# Altium schematic sheet 3V3_SUPPLY.SchDoc
size A2; SheetNumber: 5; SheetTotal: 16
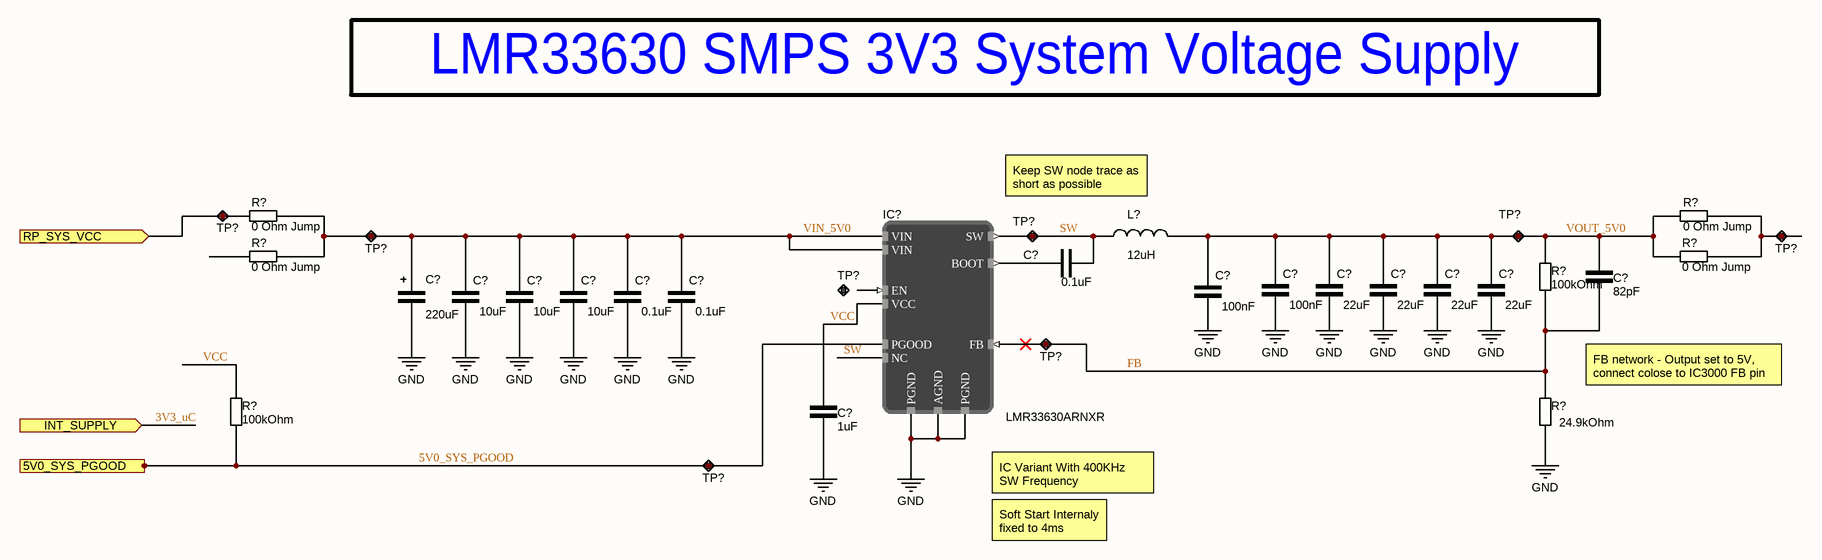
[diagram p0: 3V3_SUPPLY.SchDoc]

## Parts
(Parts that share a designator on the sheet are numbered #1, #2 ... from top to bottom, then left to right.)
C?#1  0.1uF  [CAP_0603]
C?#2  82pF  [CAP_0603]
C?#3  100nF  [CAP_0603]
C?#4  100nF  [CAP_0603]
C?#5  22uF  [CAP_1206]
C?#6  22uF  [CAP_1206]
C?#7  22uF  [CAP_1206]
C?#8  22uF  [CAP_1206]
C?#9  220uF  [CAPAE109103X103M]
C?#10  10uF  [CAP_1206]
C?#11  10uF  [CAP_1206]
C?#12  10uF  [CAP_1206]
C?#13  0.1uF  [CAP_0603]
C?#14  0.1uF  [CAP_0603]
C?#15  1uF  [CAP_0603]
IC?  LMR33630ARNXR  [VQFN-HR]
L?  12uH  [INDM120120X80N]
R?#1  0 Ohm Jump  [RES_0805]
R?#2  0 Ohm Jump  [RES_1206]
R?#3  0 Ohm Jump  [RES_0805]
R?#4  0 Ohm Jump  [RES_1206]
R?#5  100kOhm  [RES_0603]
R?#6  100kOhm  [RES_0603]
R?#7  24.9kOhm  [RES_0603]
TP?#1  Test point  [TestPoint]  (value not drawn)
TP?#2  Test point  [TestPoint]  (value not drawn)
TP?#3  Test point  [TestPoint]  (value not drawn)
TP?#4  Test point  [TestPoint]  (value not drawn)
TP?#5  Test point  [TestPoint]  (value not drawn)
TP?#6  Test point  [TestPoint]  (value not drawn)
TP?#7  Test point  [TestPoint]  (value not drawn)
TP?#8  Test point  [TestPoint]  (value not drawn)

## Ports
5V0_SYS_PGOOD (out), INT_SUPPLY (in), RP_SYS_VCC (in)

## Nets
GND: C?#4.1 C?#5.1 C?#6.1 C?#7.1 C?#8.1 C?#9.1 C?#10.1 C?#11.1 C?#12.1 C?#13.1 C?#14.1 C?#15.1 IC?.1(PGND) IC?.6(AGND) IC?.11(PGND) R?#7.1
3V3_uC: port INT_SUPPLY
5V0_SYS_PGOOD: IC?.8(PGOOD) R?#6.1 TP?#8.1 ; port 5V0_SYS_PGOOD
FB: C?#2.1 IC?.7(FB) R?#5.1 R?#7.2 TP?#7.1
RP_SYS_VCC: R?#1.1 TP?#1.1 ; port RP_SYS_VCC
SW: C?#1.2 IC?.3(NC) IC?.12(SW) L?.1 TP?#3.1
VCC: C?#15.2 IC?.5(VCC) R?#6.2
VIN_5V0: C?#9.2 C?#10.2 C?#11.2 C?#12.2 C?#13.2 C?#14.2 IC?.2(VIN) IC?.10(VIN) R?#1.2 R?#3.2 TP?#2.1
VOUT_5V0: C?#2.2 C?#3.2 C?#4.2 C?#5.2 C?#6.2 C?#7.2 C?#8.2 L?.2 R?#2.2 R?#4.1 R?#5.2 TP?#4.1
NetC?#1_1: C?#1.1 IC?.4(BOOT)
NetR?#2_1: R?#2.1 R?#4.2 TP?#5.1

Not connected (* = marked no-connect by the designer): C?#3 1; IC? 9(EN); R?#3 1; TP?#6 1

## Notes on the sheet
- LMR33630 SMPS 3V3 System Voltage Supply
- Keep SW node trace as short as possible
- FB network - Output set to 5V, connect colose to IC3000 FB pin
- (near IC?) IC Variant With 400KHz SW Frequency
- Soft Start Internaly fixed to 4ms
- Labels drawn without touching a wire or pin: GND

## Library data of the parts
C?#1 C?#13 C?#14 = C000018: 0.1 µF ±10% 50V Ceramic Capacitor X7R 0603 (1608 Metric); ComponentLink1Description: DigiKey; ComponentLink1URL: https://www.digikey.com/en/products/detail/samsung-electro-mechanics/CL10B104KB8NNNC/3886658; DigiKey Part Number: 1276-1000-1-ND; capacitance: 0.1uF
C?#2 = C000021: 82 pF ±1% 25V Ceramic Capacitor C0G, NP0 0603 (1608 Metric); ComponentLink1Description: DigiKey; ComponentLink1URL: https://www.digikey.com/en/products/detail/kyocera-avx/KGM15ACG1E820FT/1599315?s=N4IgjCBcoMxaBjKAzAhgGwM4FMA0IB7KAbXDBggF18AHAFyhAGU6AnASwDsBzEAX3xgALPBBJIaLHkIlwAVgCcAJiEB2ENRD1GLDj36CAbKPGSc%2BIpFIxlQ45u2RmbLrwEglABiEKTKDOYyViAAHEoABDQAYhq0DE4AqpzsdADyyACy2KiYAK6s2AYgALRKfpBsudKWpHIafA1AA; DigiKey Part Number: 478-KGM15ACG1E820FTCT-ND; capacitance: 82pF
C?#3 C?#4 = C000007: 0.1 µF ±10% 25V Ceramic Capacitor X7R 0603 (1608 Metric); ComponentLink1Description: DigiKey; ComponentLink1URL: https://www.digikey.com/en/products/detail/kyocera-avx/06033C104K4T2A/8019250; DigiKey Part Number: 478-KAM15AR71E104KTCT-ND; capacitance: 100nF
C?#5-C?#8 = C000020: 22 µF ±10% 25V Ceramic Capacitor X5R 1206 (3216 Metric); ComponentLink1Description: DigiKey; ComponentLink1URL: https://www.digikey.com/en/products/detail/samsung-electro-mechanics/CL31A226KAHNNNE/3888705; DigiKey Part Number: 1276-3047-1-ND; capacitance: 22uF
C?#9 = C000019: 220 µF 50 V Aluminum Electrolytic Capacitors Radial, Can - SMD 7000 Hrs @ 105°C; ComponentLink1Description: DigiKey; ComponentLink1URL: https://www.digikey.com/en/products/detail/nichicon/UCW1H221MNL1GS/2549783; DigiKey Part Number: 493-9426-1-ND; capacitance: 220uF
C?#10-C?#12 = C000017: 10 µF ±10% 50V Ceramic Capacitor X7R 1206 (3216 Metric); ComponentLink1Description: DigiKey; ComponentLink1URL: https://www.digikey.com/en/products/detail/samsung-electro-mechanics/CL31B106KBHNNNE/5961251; DigiKey Part Number: 1276-6767-1-ND; capacitance: 10uF
C?#15 = C000011: 1 µF ±10% 10V Ceramic Capacitor X7R 0603 (1608 Metric); ComponentLink1Description: DigiKey; ComponentLink1URL: https://www.digikey.com/en/products/detail/samsung-electro-mechanics/CL10B105KP8NNNC/3887604; DigiKey Part Number: 1276-1946-2-ND; capacitance: 1uF
IC? = LMR33630ARNXR: Buck Switching Regulator IC Positive Adjustable 1V 1 Output 3A 12-VFQFN; DigiKey Part Number: 296-49764-1-ND; ComponentLink1Description: DigiKey; ComponentLink1URL: https://www.digikey.com/en/products/detail/texas-instruments/LMR33630ARNXR/9356577; Mouser Part Number: 595-LMR33630ARNXR; ComponentLink2Description: Mouser; ComponentLink2URL: https://eu.mouser.com/ProductDetail/Texas-Instruments/LMR33630ARNXR?qs=55YtniHzbhBobt6bGtLStw%3D%3D
L? = L000007: FIXED IND 12UH 5.9A 24 MOHM SMD; inductance: 12uH; DigiKey Part Number: 732-1224-1-ND; ComponentLink1Description: DigiKey; ComponentLink1URL: https://www.digikey.com/en/products/detail/w%C3%BCrth-elektronik/744770112/1638629
R?#1 R?#3 = R000011: 0 Ohms Jumper Chip Resistor 0805 (2012 Metric) Automotive AEC-Q200 Thick Film; ComponentLink1Description: DigiKey; ComponentLink1URL: https://www.digikey.com/en/products/detail/panasonic-electronic-components/ERJ-6GEY0R00V/78163; resistance: 0 Ohm Jump; DigiKey Part Number: P0.0ACT-ND
R?#2 R?#4 = R000012: 0 Ohms Jumper Chip Resistor 1206 (3216 Metric) Automotive AEC-Q200 Thick Film; ComponentLink1Description: DigiKey; ComponentLink1URL: https://www.digikey.com/en/products/detail/stackpole-electronics-inc/RMCF1206ZT0R00/1756906; resistance: 0 Ohm Jump; DigiKey Part Number: RMCF1206ZT0R00CT-ND
R?#5 R?#6 = R000006: 100 kOhms ±1% 0.1W, 1/10W Chip Resistor 0603 (1608 Metric) Automotive AEC-Q200 Thick Film; resistance: 100kOhm; ComponentLink1Description: DigiKey; ComponentLink1URL: https://www.digikey.com/en/products/detail/stackpole-electronics-inc/RMCF0603FG100K/1713543; DigiKey Part Number: RMCF0603FG100KCT-ND
R?#7 = R000017: 24.9 kOhms ±1% 0.1W, 1/10W Chip Resistor 0603 (1608 Metric) Automotive AEC-Q200 Thick Film; ComponentLink1Description: DigiKey; ComponentLink1URL: https://www.digikey.com/en/products/detail/panasonic-electronic-components/ERJ-3EKF2492V/196236; resistance: 24.9kOhm; DigiKey Part Number: P24.9KHCT-ND
TP?#1-TP?#8 = TP002: Test point 1mm